# Altium schematic sheet FreqDiv.SchDoc
size 193 x 146 mm; DocumentNumber: 4; SheetNumber: 4; SheetTotal: 11
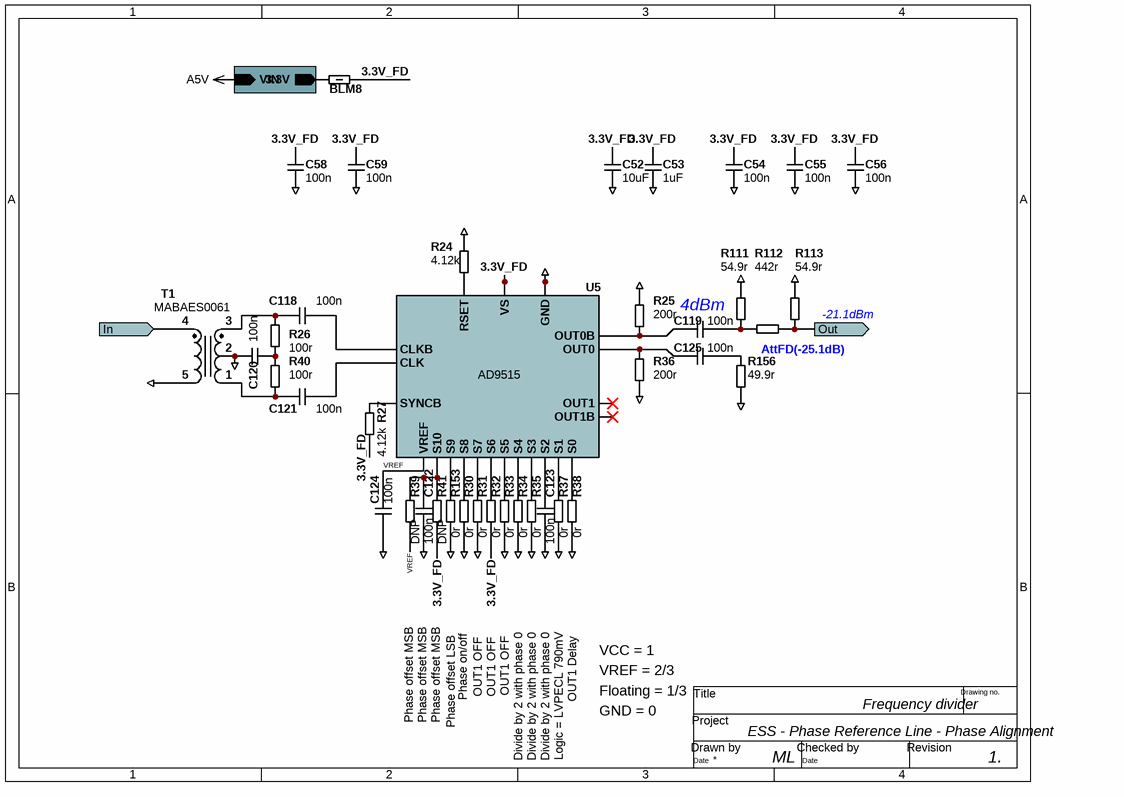
[diagram p0: FreqDiv.SchDoc]

## Parts
BLM8  120 Ohms @ 100MHz  [0402-Inductor]  (value not drawn)
C52  10uF  [1206-capacitor]
C53  1uF  [0603-Capacitor]
C54  100n  [0402-Capacitor]
C55  100n  [0402-Capacitor]
C56  100n  [0402-Capacitor]
C58  100n  [0402-Capacitor]
C59  100n  [0402-Capacitor]
C118  100n  [0402-Capacitor]
C119  100n  [0402-Capacitor]
C120  100n  [0402-Capacitor]
C121  100n  [0402-Capacitor]
C122  100n  [0402-Capacitor]
C123  100n  [0402-Capacitor]
C124  100n  [0402-Capacitor]
C125  100n  [0402-Capacitor]
R24  4.12k  [0402-RESISTOR]
R25  200r  [0402-RESISTOR]
R26  100r  [0402-RESISTOR]
R27  4.12k  [0402-RESISTOR]
R30  0r  [0402-RESISTOR]
R31  0r  [0402-RESISTOR]
R32  0r  [0402-RESISTOR]
R33  0r  [0402-RESISTOR]
R34  0r  [0402-RESISTOR]
R35  0r  [0402-RESISTOR]
R36  200r  [0402-RESISTOR]
R37  0r  [0402-RESISTOR]
R38  0r  [0402-RESISTOR]
R39  DNP  [0402-RESISTOR]  (no BOM)
R40  100r  [0402-RESISTOR]
R41  DNP  [0402-RESISTOR]  (no BOM)
R111  54.9r  [0603-RESISTOR]
R112  442r  [0603-RESISTOR]
R113  54.9r  [0603-RESISTOR]
R153  0r  [0402-RESISTOR]
R156  49.9r  [0402-RESISTOR]
T1  MABAES0061  [MABAES0061]
U5  AD9515  [LFCSP-32]

## Sub-sheets
A3.3V_FD = LDO3v3.SchDoc: 3.3V (out), VIN (in)

## Ports
In (in), Out (out)

## Nets
A5V: sheet A3.3V_FD/VIN
GND: C52.2 C53.2 C54.2 C55.2 C56.2 C58.2 C59.2 C120.2 C122.2 C123.2 C124.2 R24.2 R25.1 R30.2 R31.2 R33.2 R34.2 R35.2 R36.2 R37.2 R38.2 R111.1 R113.1 R153.2 R156.1 T1.2 T1.5 U5.31(GND) U5.EP
3.3V_FD: BLM8.1 C52.1 C53.1 C54.1 C55.1 C56.1 C58.1 C59.1 R27.2 R32.2 R41.2 U5.1(VS) U5.4(VS) U5.17(VS) U5.20(VS) U5.21(VS) U5.24(VS) U5.26(VS) U5.29(VS) U5.30(VS)
In: T1.4 ; port In
Out: R112.2 R113.2 ; port Out
VREF: C124.1 R39.2 U5.6(VREF)
NetBLM8_2: BLM8.2 ; sheet A3.3V_FD/3.3V
NetC118_1: C118.1 U5.3(CLKB)
NetC118_2: C118.2 R26.1 T1.3
NetC119_1: C119.1 R111.2 R112.1
NetC119_2: C119.2 R25.2 U5.22(OUT0B)
NetC120_1: C120.1 R26.2 R40.1
NetC121_1: C121.1 U5.2(CLK)
NetC121_2: C121.2 R40.2 T1.1
NetC122_1: C122.1 R39.1 R41.1 U5.7(S10)
NetC123_1: C123.1 U5.15(S2)
NetC125_1: C125.1 R156.2
NetC125_2: C125.2 R36.1 U5.23(OUT0)
NetR24_1: R24.1 U5.32(RSET)
NetR27_1: R27.1 U5.5(SYNCB)
NetR30_1: R30.1 U5.9(S8)
NetR31_1: R31.1 U5.10(S7)
NetR32_1: R32.1 U5.11(S6)
NetR33_1: R33.1 U5.12(S5)
NetR34_1: R34.1 U5.13(S4)
NetR35_1: R35.1 U5.14(S3)
NetR37_1: R37.1 U5.16(S1)
NetR38_1: R38.1 U5.25(S0)
NetR153_1: R153.1 U5.8(S9)

Not connected (* = marked no-connect by the designer): U5 18(OUT1B)* 19(OUT1)* 27(DNC) 28(DNC)

## Notes on the sheet
- (near C119) 4dBm
- -21.1dBm
- AttFD(-25.1dB)
- OUT1 OFF
- OUT1 Delay
- VREF = 2/3
- VCC = 1
- Phase offset MSB
- Phase offset LSB
- Phase on/off
- Divide by 2 with phase 0
- Logic = LVPECL 790mV
- Floating = 1/3
- GND = 0
- ESS - Phase Reference Line - Phase Alignment
- Frequency divider
- ML
- 1.
- Title
- Project
- Drawing no.
- Date
- Drawn by
- Checked by
- Revision

## Library data of the parts
BLM8 = BLM15AX121SZ1D: 120 Ohms @ 100MHz 1 Power, Signal Line Ferrite Bead 0402 (1005 Metric) 700mA 130mOhm; Case: 0402; Supplier 1: Digi-Key; Supplier Part Number 1: 490-16510-1-ND; HelpURL: https://www.murata.com/en-us/products/productdata/8796748677150/QNFA9118.pdf
C52 = C_1206: Capacitor 1206; Voltage Rating: 16V; Tolerance: ±20%; Dielectric: X7R/C0G; Value: 10uF; Case: 1206
C53 = C_0603: Capacitor 0603; Tolerance: ±20%; Voltage Rating: 16V; Dielectric: X7R/C0G; Value: 1uF; Case: 0603
C54-C56 C58 C59 C118-C125 = C_0402: Capacitor 0402; Tolerance: ±20%; Voltage Rating: 16V; Dielectric: X7R/C0G; Value: 100n; Case: 0402
R24-R27 R30-R38 R40 R153 R156 = R_0402: Resistor 0402; Tolerance: ±1%; Case: 0402
  R24 R27: Value: 4.12k
  R25 R36: Value: 200r
  R26 R40: Value: 100r
  R30-R35 R37 R38 R153: Value: 0r
  R156: Value: 49.9r
R39 R41 = R_0402: Resistor 0402; Value: 0r; Tolerance: ±1%; Case: 0402
R111-R113 = R_0603: Resistor 0603; Tolerance: ±1%; Case: 0603
  R111 R113: Value: 54.9r
  R112: Value: 442r
T1 = MABAES0061: 1:4 E-Series, RF Flux Coupled Transformer / 2 - 800 MHz; HelpURL: https://cdn.macom.com/datasheets/MABAES0061.pdf; Case: MABAES0061; Supplier 1: Digi-Key; Supplier Part Number 1: 1465-1318-1-ND; Value: 1:4
U5 = AD9515: 1.6 GHz Clock Distribution IC, Dividers, Delay Adjust, Two Outputs; HelpURL: https://www.analog.com/media/en/technical-documentation/data-sheets/AD9515.pdf; Case: LFCSP32; Supplier 1: Digi-Key; Supplier Part Number 1: AD9515BCPZ-REEL7CT-ND